# Altium schematic sheet ADS5553.SchDoc
size A4
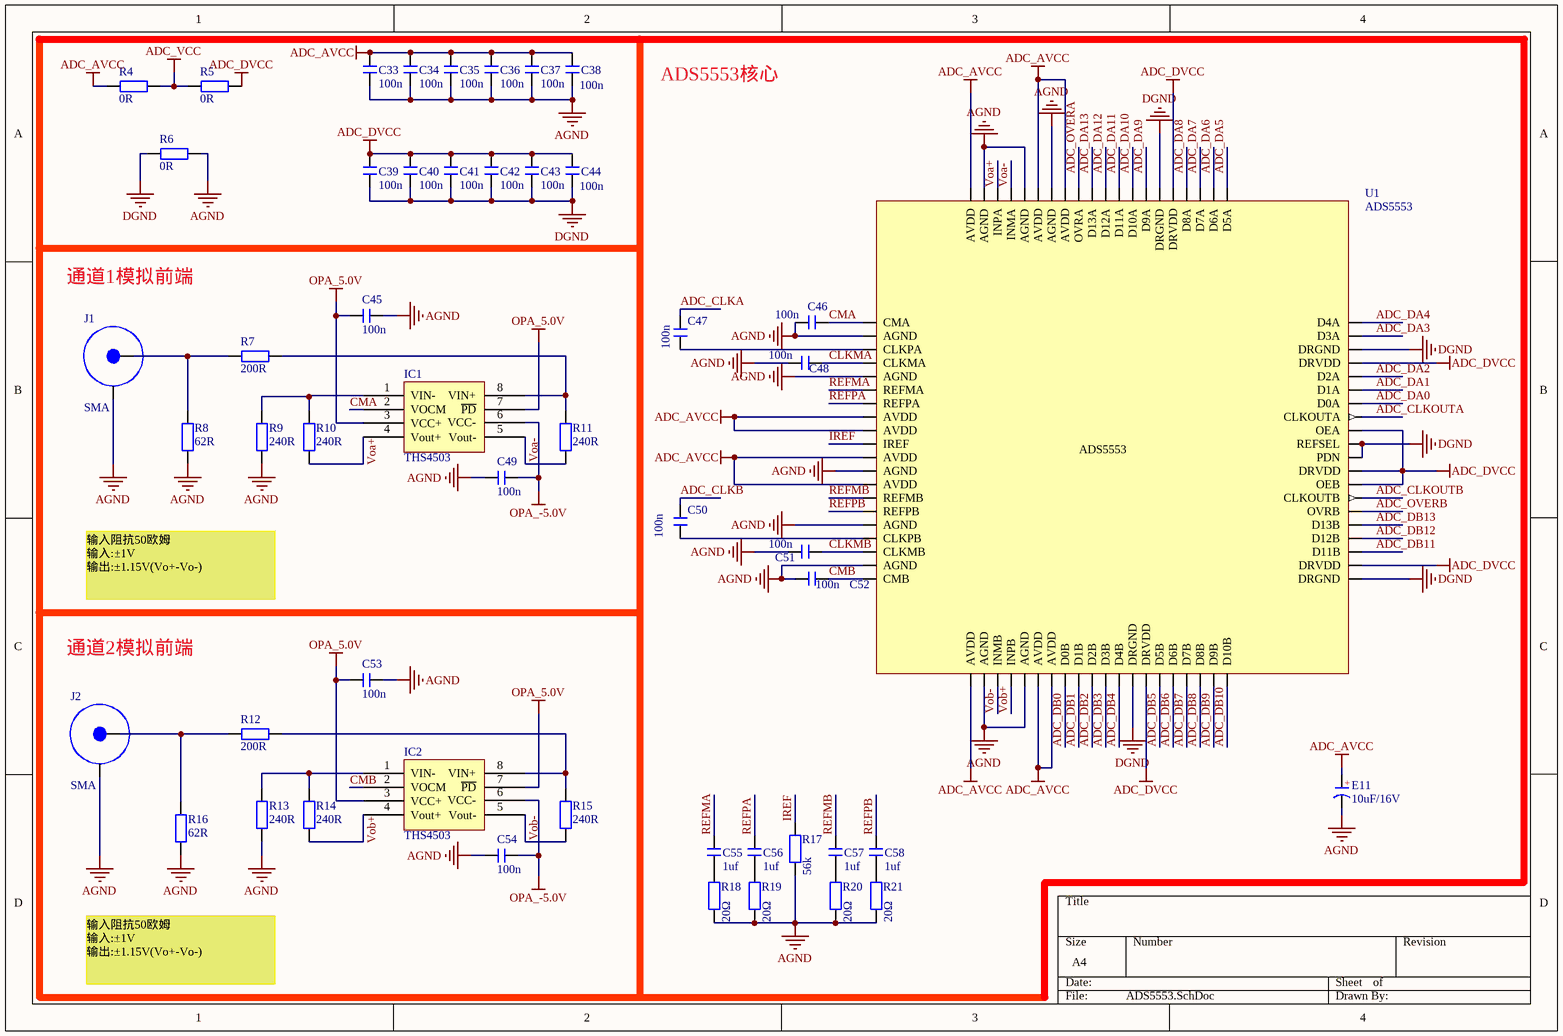
[diagram p0: ADS5553.SchDoc]

## Parts
C33  100n  [C 0805_M]
C34  100n  [C 0805_M]
C35  100n  [C 0805_M]
C36  100n  [C 0805_M]
C37  100n  [C 0805_M]
C38  100n  [C 0805_M]
C39  100n  [C 0805_M]
C40  100n  [C 0805_M]
C41  100n  [C 0805_M]
C42  100n  [C 0805_M]
C43  100n  [C 0805_M]
C44  100n  [C 0805_M]
C45  100n  [C 0805_M]
C46  100n  [C 0805_M]
C47  100n  [C 0805_M]
C48  100n  [C 0805_M]
C49  100n  [C 0805_M]
C50  100n  [C 0805_M]
C51  100n  [C 0805_M]
C52  100n  [C 0805_M]
C53  100n  [C 0805_M]
C54  100n  [C 0805_M]
C55  1uf  [C 0805_M]
C56  1uf  [C 0805_M]
C57  1uf  [C 0805_M]
C58  1uf  [C 0805_M]
E11  10uF/16V  [C 1210_M]
IC1  THS4503  [SOP8_M]
IC2  THS4503  [SOP8_M]
J1  SMA  [SMA_FR]
J2  SMA  [SMA_FR]
R4  0R  [R 0805_M]
R5  0R  [R 0805_M]
R6  0R  [R 1206_M]
R7  200R  [R 0805_M]
R8  62R  [R 0805_M]
R9  240R  [R 0805_M]
R10  240R  [R 0805_M]
R11  240R  [R 0805_M]
R12  200R  [R 0805_M]
R13  240R  [R 0805_M]
R14  240R  [R 0805_M]
R15  240R  [R 0805_M]
R16  62R  [R 0805_M]
R17  56k  [R 0805_M]
R18  20Ω  [R 0805_M]
R19  20Ω  [R 0805_M]
R20  20Ω  [R 0805_M]
R21  20Ω  [R 0805_M]
U1  ADS5553  [LQFP80 12x12_M]

## Nets
ADC_AVCC: C33.2 C34.2 C35.2 C36.2 C37.2 C38.2 E11.1(A) R4.2 U1.8(AVDD) U1.9(AVDD) U1.11(AVDD) U1.13(AVDD) U1.21(AVDD) U1.26(AVDD) U1.27(AVDD) U1.73(AVDD) U1.75(AVDD) U1.80(AVDD)
ADC_DVCC: C39.2 C40.2 C41.2 C42.2 C43.2 C44.2 R5.1 U1.34(DRVDD) U1.42(DRVDD) U1.48(OEB) U1.49(DRVDD) U1.52(OEA) U1.57(DRVDD) U1.65(DRVDD)
ADC_VCC: R4.1 R5.2
AGND: C33.1 C34.1 C35.1 C36.1 C37.1 C38.1 C45.2 C46.1 C48.1 C49.1 C51.1 C52.1 C53.2 C54.1 E11.2(K) J1.2 J2.2 R6.1 R8.2 R9.1 R13.1 R16.1 R17.1 R18.1 R19.1 R20.1 R21.1 U1.2(AGND) U1.5(AGND) U1.12(AGND) U1.16(AGND) U1.19(AGND) U1.22(AGND) U1.25(AGND) U1.74(AGND) U1.76(AGND) U1.79(AGND)
DGND: C39.1 C40.1 C41.1 C42.1 C43.1 C44.1 R6.2 U1.33(DRGND) U1.41(DRGND) U1.50(PDN) U1.51(REFSEL) U1.58(DRGND) U1.66(DRGND)
OPA_5.0V: C45.1 C53.1 IC1.3(VCC+) IC1.7(~{PD}) IC2.3(VCC+) IC2.7(~{PD})
OPA_-5.0V: C49.2 C54.2 IC1.6(VCC-) IC2.6(VCC-)
ADC_CLKA: C47.2
ADC_CLKB: C50.2
ADC_CLKOUTA: U1.53(CLKOUTA)
ADC_CLKOUTB: U1.47(CLKOUTB)
ADC_DA0: U1.54(D0A)
ADC_DA1: U1.55(D1A)
ADC_DA2: U1.56(D2A)
ADC_DA3: U1.59(D3A)
ADC_DA4: U1.60(D4A)
ADC_DA5: U1.61(D5A)
ADC_DA6: U1.62(D6A)
ADC_DA7: U1.63(D7A)
ADC_DA8: U1.64(D8A)
ADC_DA9: U1.67(D9A)
ADC_DA10: U1.68(D10A)
ADC_DA11: U1.69(D11A)
ADC_DA12: U1.70(D12A)
ADC_DA13: U1.71(D13A)
ADC_DB0: U1.28(D0B)
ADC_DB1: U1.29(D1B)
ADC_DB2: U1.30(D2B)
ADC_DB3: U1.31(D3B)
ADC_DB4: U1.32(D4B)
ADC_DB5: U1.35(D5B)
ADC_DB6: U1.36(D6B)
ADC_DB7: U1.37(D7B)
ADC_DB8: U1.38(D8B)
ADC_DB9: U1.39(D9B)
ADC_DB10: U1.40(D10B)
ADC_DB11: U1.43(D11B)
ADC_DB12: U1.44(D12B)
ADC_DB13: U1.45(D13B)
ADC_OVERA: U1.72(OVRA)
ADC_OVERB: U1.46(OVRB)
CLKMA: C48.2 U1.4(CLKMA)
CLKMB: C51.2 U1.18(CLKMB)
CMA: C46.2 IC1.2(VOCM) U1.1(CMA)
CMB: C52.2 IC2.2(VOCM) U1.20(CMB)
IREF: R17.2 U1.10(IREF)
REFMA: C55.2 U1.6(REFMA)
REFMB: C57.2 U1.14(REFMB)
REFPA: C56.2 U1.7(REFPA)
REFPB: C58.2 U1.15(REFPB)
Voa+: IC1.4(Vout+) R10.1 U1.78(INPA)
Voa-: IC1.5(Vout-) R11.1 U1.77(INMA)
Vob+: IC2.4(Vout+) R14.1 U1.24(INPB)
Vob-: IC2.5(Vout-) R15.1 U1.23(INMB)
NetC47_1: C47.1 U1.3(CLKPA)
NetC50_1: C50.1 U1.17(CLKPB)
NetC55_1: C55.1 R18.2
NetC56_1: C56.1 R19.2
NetC57_1: C57.1 R20.2
NetC58_1: C58.1 R21.2
NetIC1_1: IC1.1(VIN-) R9.2 R10.2
NetIC1_8: IC1.8(VIN+) R7.1 R11.2
NetIC2_1: IC2.1(VIN-) R13.2 R14.2
NetIC2_8: IC2.8(VIN+) R12.1 R15.2
NetJ1_1: J1.1 R7.2 R8.1
NetJ2_1: J2.1 R12.2 R16.2

## Notes on the sheet
- ADS5553核心
- 通道1模拟前端
- 通道2模拟前端
- 输入阻抗50欧姆
  输入:±1V
  输出:±1.15V(Vo+-Vo-)
- (in symbol C-CAP) +

## Library data of the parts
C33-C58 = C: 无极性贴片电容; 版权归属: 源创客; BOM名称: 无极性贴片电容; 学习资源: www.ooocke.com
E11 = C-CAP: 直插电解电容; 版权归属: 源创客; BOM名称: 直插电解电容; 学习资源: www.ooocke.com
IC1 IC2 = 24Cxx: 外置EEPROM; 版权归属: 源创客; BOM名称: 外置EEPROM; 学习资源: www.ooocke.com
R4-R21 = R: 贴片电阻; 版权归属: 源创客; BOM名称: 贴片电阻; 学习资源: www.ooocke.com